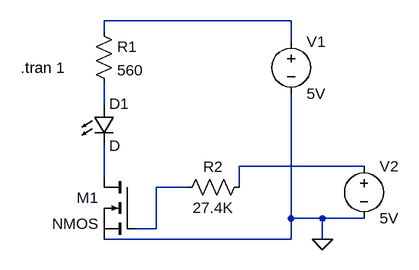
[diagram p0: schematic led_raspi_circuit.asc]
led_raspi_circuit.asc, the LTspice schematic file:
Version 4
SHEET 1 880 680
WIRE 560 160 272 160
WIRE 272 176 272 160
WIRE 560 192 560 160
WIRE 272 288 272 256
WIRE 672 384 480 384
WIRE 272 400 272 352
WIRE 400 416 352 416
WIRE 480 416 480 384
WIRE 560 464 560 272
WIRE 608 464 560 464
WIRE 672 464 608 464
WIRE 352 480 352 416
WIRE 352 480 320 480
WIRE 560 496 560 464
WIRE 560 496 272 496
WIRE 608 496 608 464
FLAG 608 496 0
SYMBOL res 256 160 R0
SYMATTR InstName R1
SYMATTR Value 560
SYMBOL res 496 400 R90
WINDOW 0 0 56 VBottom 2
WINDOW 3 32 56 VTop 2
SYMATTR InstName R2
SYMATTR Value 27.4K
SYMBOL LED 256 288 R0
SYMATTR InstName D1
SYMBOL nmos 320 400 M0
SYMATTR InstName M1
SYMBOL voltage 560 176 R0
SYMATTR InstName V1
SYMATTR Value 5V
SYMBOL voltage 672 368 R0
SYMATTR InstName V2
SYMATTR Value 5V
TEXT 144 232 Left 2 !.tran 1

The netlist it stands for:
* led_raspi_circuit.asc
R1 N001 N002 560
R2 N003 N005 27.4K
D1 N002 N004 D
M1 N004 N005 0 0 NMOS
V1 N001 0 5V
V2 N003 0 5V
.model D D
.lib standard.dio
.model NMOS NMOS
.model PMOS PMOS
.lib standard.mos
.tran 1
.backanno
.end